# Altium project ADC_board.PrjPCB
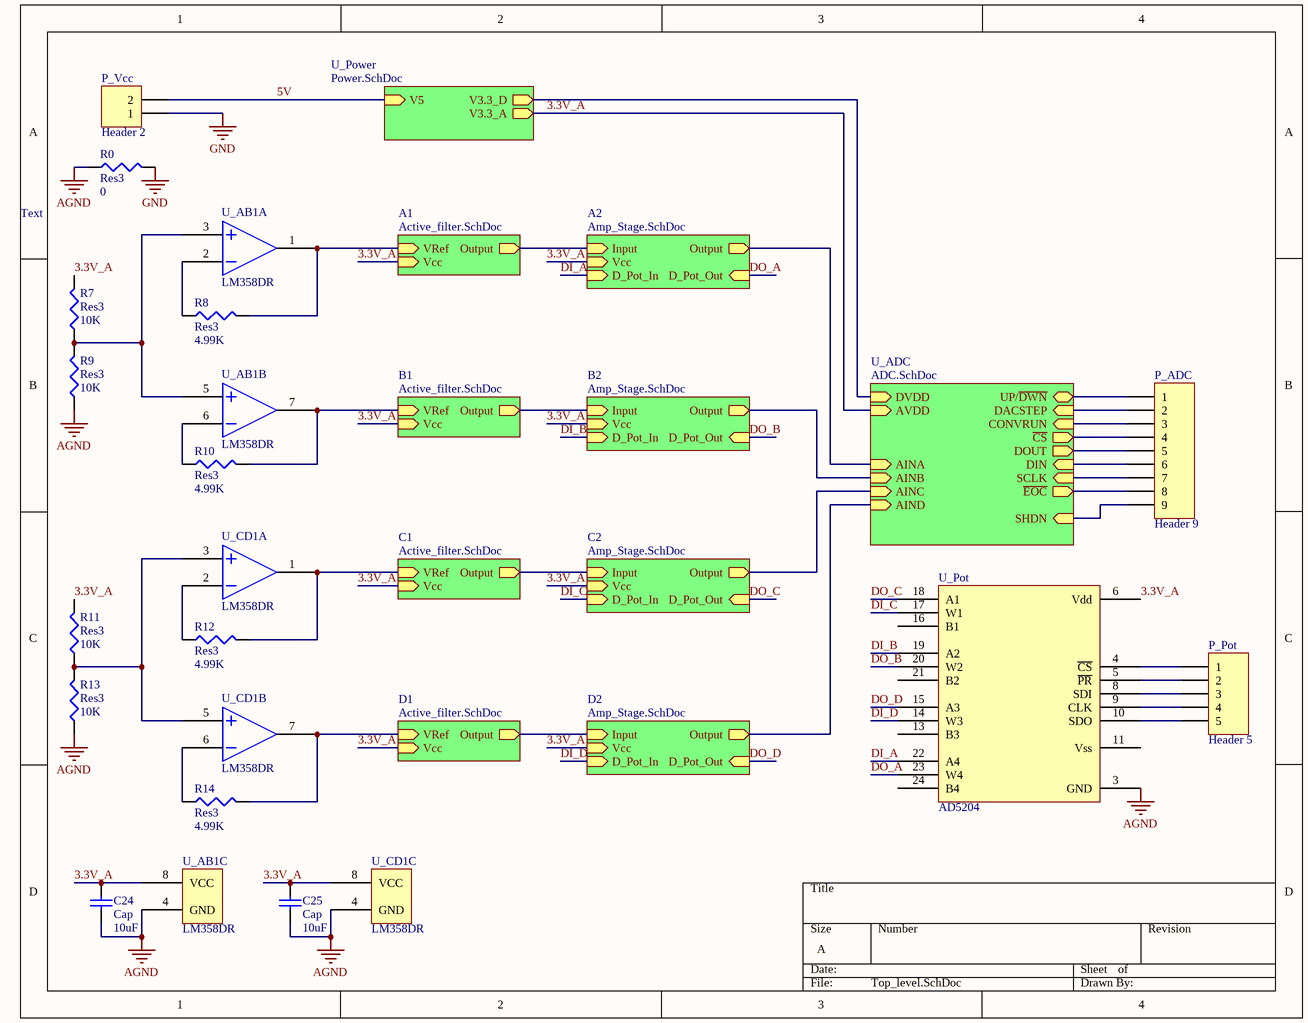
[diagram p0: Top_level.SchDoc]
3 sheets, 85 parts. Net scope: hierarchical (ports join the sheet entries above them; power ports are global).
Board file: PCB1.PcbDoc
Sheets:
  Top_level.SchDoc
    U_ADC = ADC.SchDoc
    A1 = Active_filter.SchDoc
    B1 = Active_filter.SchDoc
    C1 = Active_filter.SchDoc
    D1 = Active_filter.SchDoc

## Sheet Top_level.SchDoc
size A

### Parts
C24  Cap  value 10uF  [1608[0603]]
C25  Cap  value 10uF  [1608[0603]]
P_ADC  Header 9  [HDR1X9]
P_Pot  Header 5  [HDR1X5]
P_Vcc  Header 2  [HDR1X2]
R0  Res3  value 0  [J1-0603]
R7  Res3  value 10K  [J1-0603]
R8  Res3  value 4.99K  [J1-0603]
R9  Res3  value 10K  [J1-0603]
R10  Res3  value 4.99K  [J1-0603]
R11  Res3  value 10K  [J1-0603]
R12  Res3  value 4.99K  [J1-0603]
R13  Res3  value 10K  [J1-0603]
R14  Res3  value 4.99K  [J1-0603]
U_AB1  LM358DR  [SOIC127P600X175-8N(lm358)]  (parts A,B,C of 3)
U_CD1  LM358DR  [SOIC127P600X175-8N(lm358)]  (parts A,B,C of 3)
U_Pot  AD5204  [SOIC127P1030X265-24N(AD5204)]

### Sub-sheets
A1 = Active_filter.SchDoc: Output (out), Vcc (in), VRef (in)
A2 = Amp_Stage.SchDoc (file not in this document): D_Pot_In (in), D_Pot_Out (in), Input (in), Vcc (in), Output (out)
B1 = Active_filter.SchDoc: Output (out), Vcc (in), VRef (in)
B2 = Amp_Stage.SchDoc (file not in this document): Input (in), Output (out), Vcc (in), D_Pot_In (in), D_Pot_Out (in)
C1 = Active_filter.SchDoc: Output (out), Vcc (in), VRef (in)
C2 = Amp_Stage.SchDoc (file not in this document): Input (in), Output (out), Vcc (in), D_Pot_In (in), D_Pot_Out (in)
D1 = Active_filter.SchDoc: Output (out), Vcc (in), VRef (in)
D2 = Amp_Stage.SchDoc (file not in this document): Input (in), Output (out), Vcc (in), D_Pot_In (in), D_Pot_Out (in)
U_ADC = ADC.SchDoc: SHDN (in), SCLK (in), DIN (in), DOUT (out), ~{CS} (out), CONVRUN (in), UP/~{DWN}, ~{EOC} (out), DACSTEP (in), AINC (in), AINA (in), DVDD (in), AINB (in), AIND (in), AVDD (in)
U_Power = Power.SchDoc (file not in this document): V5 (in), V3.3_A (out), V3.3_D (out)

### Nets
3.3V_A: C24.2 C25.2 R7.2 R11.2 U_AB1.8(VCC) U_CD1.8(VCC) U_Pot.6(Vdd) ; sheet U_ADC/AVDD, sheet U_Power/V3.3_A, sheet A1/Vcc, sheet B1/Vcc, sheet C1/Vcc, sheet D1/Vcc, sheet A2/Vcc, sheet B2/Vcc, sheet C2/Vcc, sheet D2/Vcc
AGND: C24.1 C25.1 R0.1 R9.1 R13.1 U_AB1.4(GND) U_CD1.4(GND) U_Pot.3(GND)
DVDD: sheet U_ADC/DVDD, sheet U_Power/V3.3_D
GND: P_Vcc.1 R0.2
Vref: R8.2 R10.2 R12.2 R14.2 U_AB1.1(1OUT) U_AB1.7(2OUT) U_CD1.1(1OUT) U_CD1.7(2OUT) ; sheet A1/VRef, sheet B1/VRef, sheet C1/VRef, sheet D1/VRef
5V: P_Vcc.2 ; sheet U_Power/V5
DI_A: U_Pot.22(A4) ; sheet A2/D_Pot_In
DI_B: U_Pot.19(A2) ; sheet B2/D_Pot_In
DI_C: U_Pot.17(W1) ; sheet C2/D_Pot_In
DI_D: U_Pot.14(W3) ; sheet D2/D_Pot_In
DO_A: U_Pot.23(W4) ; sheet A2/D_Pot_Out
DO_B: U_Pot.20(W2) ; sheet B2/D_Pot_Out
DO_C: U_Pot.18(A1) ; sheet C2/D_Pot_Out
DO_D: U_Pot.15(A3) ; sheet D2/D_Pot_Out
NetC2_A1_2: sheet A1/Output, sheet A2/Input
NetC2_B1_2: sheet B1/Output, sheet B2/Input
NetC2_C1_2: sheet C1/Output, sheet C2/Input
NetC2_D1_2: sheet D1/Output, sheet D2/Input
NetP_ADC_1: P_ADC.1 ; sheet U_ADC/UP/~{DWN}
NetP_ADC_2: P_ADC.2 ; sheet U_ADC/DACSTEP
NetP_ADC_3: P_ADC.3 ; sheet U_ADC/CONVRUN
NetP_ADC_4: P_ADC.4 ; sheet U_ADC/~{CS}
NetP_ADC_5: P_ADC.5 ; sheet U_ADC/DOUT
NetP_ADC_6: P_ADC.6 ; sheet U_ADC/DIN
NetP_ADC_7: P_ADC.7 ; sheet U_ADC/SCLK
NetP_ADC_8: P_ADC.8 ; sheet U_ADC/~{EOC}
NetP_ADC_9: P_ADC.9 ; sheet U_ADC/SHDN
NetP_Pot_1: P_Pot.1 U_Pot.4(~{CS})
NetP_Pot_2: P_Pot.2 U_Pot.5(~{PR})
NetP_Pot_3: P_Pot.3 U_Pot.8(SDI)
NetP_Pot_4: P_Pot.4 U_Pot.9(CLK)
NetP_Pot_5: P_Pot.5 U_Pot.10(SDO)
NetR7_1: R7.1 R9.2 U_AB1.3(1IN+) U_AB1.5(2IN+)
NetR8_1: R8.1 U_AB1.2(1IN-)
NetR10_1: R10.1 U_AB1.6(2IN-)
NetR11_1: R11.1 R13.2 U_CD1.3(1IN+) U_CD1.5(2IN+)
NetR12_1: R12.1 U_CD1.2(1IN-)
NetR14_1: R14.1 U_CD1.6(2IN-)
NetU2_4: sheet U_ADC/AINA, sheet A2/Output
NetU2_32: sheet U_ADC/AIND, sheet D2/Output
NetU2_37: sheet U_ADC/AINC, sheet C2/Output
NetU2_40: sheet U_ADC/AINB, sheet B2/Output

Not connected (* = marked no-connect by the designer): U_Pot 11(Vss) 13(B3) 16(B1) 21(B2) 24(B4)

### Notes on the sheet
- Text

### Library data of the parts
C24 C25 = Cap: Capacitor; Published: 8-Jun-2000; LatestRevisionDate: 17-Jul-2002; LatestRevisionNote: Re-released for DXP Platform.; PackageReference: RAD-0.3; Publisher: Altium Limited; PackageDescription: Radial Cap, Thru-Hole; 2 Leads; 0.3 in Pin Spacing
P_ADC = Header 9: Header, 9-Pin; LatestRevisionDate: 17-Jul-2002; LatestRevisionNote: Re-released for DXP Platform.; Publisher: Altium Limited
P_Pot = Header 5: Header, 5-Pin; LatestRevisionDate: 17-Jul-2002; LatestRevisionNote: Re-released for DXP Platform.; Publisher: Altium Limited
P_Vcc = Header 2: Header, 2-Pin; LatestRevisionDate: 17-Jul-2002; LatestRevisionNote: Re-released for DXP Platform.; Publisher: Altium Limited
R0 R7-R14 = Res3: Resistor; Published: 8-Jun-2000; LatestRevisionDate: 29-May-2009; LatestRevisionNote: IPC-7351 Footprint Added.; PackageReference: J1-0603; Publisher: Altium Limited; PackageDescription: Chip Resistor

## Sheet ADC.SchDoc
size A
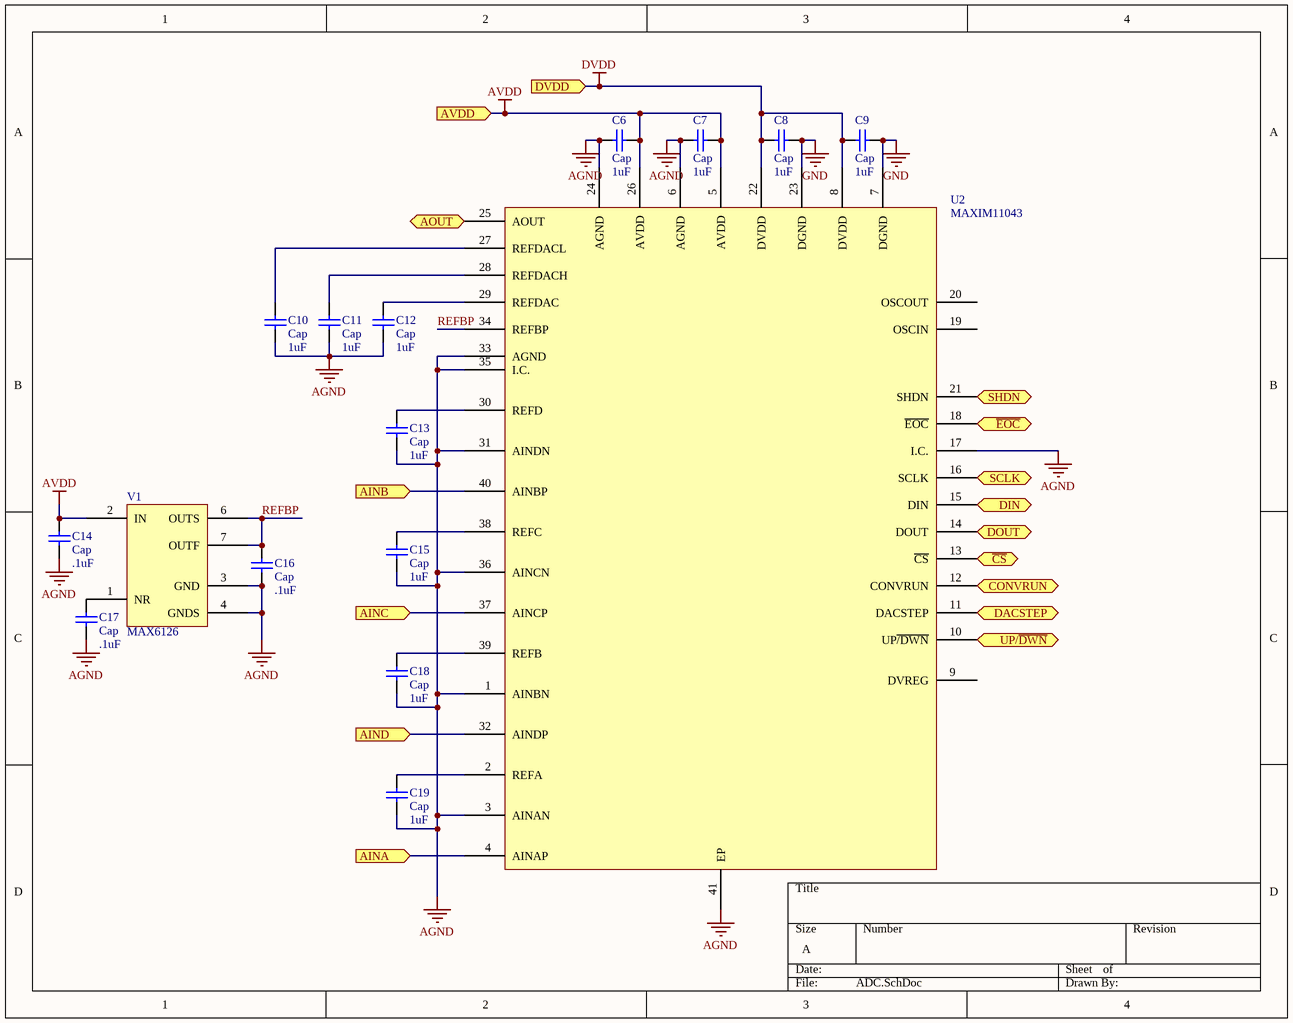
[diagram p1: ADC.SchDoc]

### Parts
C6  Cap  value 1uF  [1608[0603]]
C7  Cap  value 1uF  [1608[0603]]
C8  Cap  value 1uF  [1608[0603]]
C9  Cap  value 1uF  [1608[0603]]
C10  Cap  value 1uF  [1608[0603]]
C11  Cap  value 1uF  [1608[0603]]
C12  Cap  value 1uF  [1608[0603]]
C13  Cap  value 1uF  [1608[0603]]
C14  Cap  value .1uF  [1608[0603]]
C15  Cap  value 1uF  [1608[0603]]
C16  Cap  value .1uF  [1608[0603]]
C17  Cap  value .1uF  [1608[0603]]
C18  Cap  value 1uF  [1608[0603]]
C19  Cap  value 1uF  [1608[0603]]
U2  MAXIM11043  [21-0141I_T406600]
V1  MAX6126  [SOIC127P600X175-8N(lm358)]

### Ports
AINA (in), AINB (in), AINC (in), AIND (in), AOUT (out), AVDD (in), CONVRUN (in), DACSTEP (in), DIN (in), DOUT (out), DVDD (in), SCLK (in), SHDN (in), UP/~{DWN}, ~{CS} (out), ~{EOC} (out)

### Nets
AGND: C6.1 C7.1 C10.1 C11.1 C12.1 C13.1 C14.1 C15.1 C16.1 C17.1 C18.1 C19.1 U2.1(AINBN) U2.3(AINAN) U2.6(AGND) U2.17(I.C.) U2.24(AGND) U2.31(AINDN) U2.33(AGND) U2.35(I.C.) U2.36(AINCN) U2.41(EP) V1.3(GND) V1.4(GNDS)
AVDD: C6.2 C7.2 C14.2 U2.5(AVDD) U2.26(AVDD) V1.2(IN) ; port AVDD  [project net 3.3V_A]
DVDD: C8.1 C9.1 U2.8(DVDD) U2.22(DVDD) ; port DVDD
GND: C8.2 C9.2 U2.7(DGND) U2.23(DGND)
REFBP: C16.2 U2.34(REFBP) V1.6(OUTS) V1.7(OUTF)
NetC10_2: C10.2 U2.27(REFDACL)
NetC11_2: C11.2 U2.28(REFDACH)
NetC12_2: C12.2 U2.29(REFDAC)
NetC13_2: C13.2 U2.30(REFD)
NetC15_2: C15.2 U2.38(REFC)
NetC17_2: C17.2 V1.1(NR)
NetC18_2: C18.2 U2.39(REFB)
NetC19_2: C19.2 U2.2(REFA)
NetP_ADC_1: U2.10(UP~{/DWN}) ; port UP/~{DWN}
NetP_ADC_2: U2.11(DACSTEP) ; port DACSTEP
NetP_ADC_3: U2.12(CONVRUN) ; port CONVRUN
NetP_ADC_4: U2.13(~{CS}) ; port ~{CS}
NetP_ADC_5: U2.14(DOUT) ; port DOUT
NetP_ADC_6: U2.15(DIN) ; port DIN
NetP_ADC_7: U2.16(SCLK) ; port SCLK
NetP_ADC_8: U2.18(~{EOC}) ; port ~{EOC}
NetP_ADC_9: U2.21(SHDN) ; port SHDN
NetU2_4: U2.4(AINAP) ; port AINA
NetU2_25: U2.25(AOUT) ; port AOUT
NetU2_32: U2.32(AINDP) ; port AIND
NetU2_37: U2.37(AINCP) ; port AINC
NetU2_40: U2.40(AINBP) ; port AINB

Not connected (* = marked no-connect by the designer): U2 9(DVREG) 19(OSCIN) 20(OSCOUT)

### Library data of the parts
C6-C19 = Cap: Capacitor; Published: 8-Jun-2000; LatestRevisionDate: 17-Jul-2002; LatestRevisionNote: Re-released for DXP Platform.; PackageReference: RAD-0.3; Publisher: Altium Limited; PackageDescription: Radial Cap, Thru-Hole; 2 Leads; 0.3 in Pin Spacing

## Sheet Active_filter.SchDoc
size A
Used 4 times, as channels A1, B1, C1, D1. Parts and nets are listed once, with the designators drawn on the sheet.
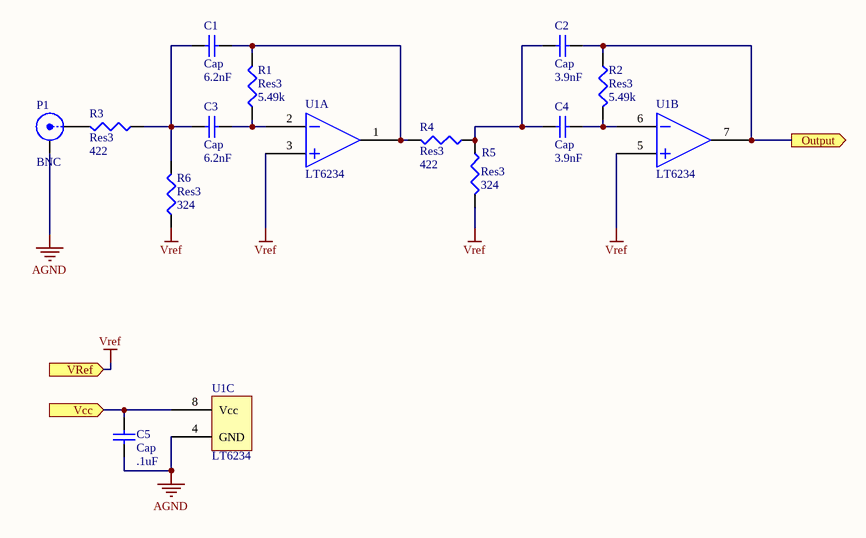
[diagram p2: Active_filter.SchDoc]

### Parts
C1  Cap  value 6.2nF  [1608[0603]]
C2  Cap  value 3.9nF  [1608[0603]]
C3  Cap  value 6.2nF  [1608[0603]]
C4  Cap  value 3.9nF  [1608[0603]]
C5  Cap  value .1uF  [1608[0603]]
P1  BNC  [BNC_RA CON]
R1  Res3  value 5.49k  [1608[0603]]
R2  Res3  value 5.49k  [J1-0603]
R3  Res3  value 422  [1608[0603]]
R4  Res3  value 422  [J1-0603]
R5  Res3  value 324  [J1-0603]
R6  Res3  value 324  [1608[0603]]
U1  LT6234  [SOIC127P600X150-8N(LT6233)]  (parts A,B,C of 3)

### Ports
Output (out), Vcc (in), VRef (in)

### Nets
AGND: C5.1 P1.2(Y) U1.4(GND)
Vref: R5.2 R6.1 U1.3(+IN_A) U1.5(+IN_B) ; port VRef
Output: C2.2 R2.1 U1.7(OUT_B) ; port Output
Vcc: C5.2 U1.8(Vcc) ; port Vcc
NetC1_1: C1.1 C3.1 R3.1 R6.2
NetC1_2: C1.2 R1.2 R4.2 U1.1(OUT_A)
NetC2_1: C2.1 C4.2 R4.1 R5.1
NetC3_2: C3.2 R1.1 U1.2(-IN_A)
NetC4_1: C4.1 R2.2 U1.6(-IN_B)
NetP1_1: P1.1(X) R3.2

### Channels
A1: designators end in _A1; ports Output=NetC2_A1_2 Vcc=3.3V_A VRef=Vref
B1: designators end in _B1; ports Output=NetC2_B1_2 Vcc=3.3V_A VRef=Vref
C1: designators end in _C1; ports Output=NetC2_C1_2 Vcc=3.3V_A VRef=Vref
D1: designators end in _D1; ports Output=NetC2_D1_2 Vcc=3.3V_A VRef=Vref

### Library data of the parts
C1-C5 = Cap: Capacitor; Published: 8-Jun-2000; LatestRevisionDate: 17-Jul-2002; LatestRevisionNote: Re-released for DXP Platform.; PackageReference: RAD-0.3; Publisher: Altium Limited; PackageDescription: Radial Cap, Thru-Hole; 2 Leads; 0.3 in Pin Spacing
P1 = BNC: BNC Elbow Connector; LatestRevisionDate: 17-Jul-2002; LatestRevisionNote: Re-released for DXP Platform.; Publisher: Altium Limited
R1-R6 = Res3: Resistor; Published: 8-Jun-2000; LatestRevisionDate: 29-May-2009; LatestRevisionNote: IPC-7351 Footprint Added.; PackageReference: J1-0603; Publisher: Altium Limited; PackageDescription: Chip Resistor

## Nets that join several sheets
3.3V_A: Top_level (7 pins), ADC (6 pins), A1 (C5_A1.2 U1_A1.8), B1 (C5_B1.2 U1_B1.8), C1 (C5_C1.2 U1_C1.8), D1 (C5_D1.2 U1_D1.8)
AGND: Top_level (8 pins), ADC (24 pins), A1 (C5_A1.1 P1_A1.2 U1_A1.4), B1 (C5_B1.1 P1_B1.2 U1_B1.4), C1 (C5_C1.1 P1_C1.2 U1_C1.4), D1 (C5_D1.1 P1_D1.2 U1_D1.4)
GND: Top_level (P_Vcc.1 R0.2), ADC (C8.2 C9.2 U2.7 U2.23)
Vref: Top_level (8 pins), A1 (R5_A1.2 R6_A1.1 U1_A1.3 U1_A1.5), B1 (R5_B1.2 R6_B1.1 U1_B1.3 U1_B1.5), C1 (R5_C1.2 R6_C1.1 U1_C1.3 U1_C1.5), D1 (R5_D1.2 R6_D1.1 U1_D1.3 U1_D1.5)
NetP_ADC_1: Top_level (P_ADC.1), ADC (U2.10)
NetP_ADC_2: Top_level (P_ADC.2), ADC (U2.11)
NetP_ADC_3: Top_level (P_ADC.3), ADC (U2.12)
NetP_ADC_4: Top_level (P_ADC.4), ADC (U2.13)
NetP_ADC_5: Top_level (P_ADC.5), ADC (U2.14)
NetP_ADC_6: Top_level (P_ADC.6), ADC (U2.15)
NetP_ADC_7: Top_level (P_ADC.7), ADC (U2.16)
NetP_ADC_8: Top_level (P_ADC.8), ADC (U2.18)
NetP_ADC_9: Top_level (P_ADC.9), ADC (U2.21)